# EAGLE schematic Dazzler-noaudio (EAGLE 8.7.0)
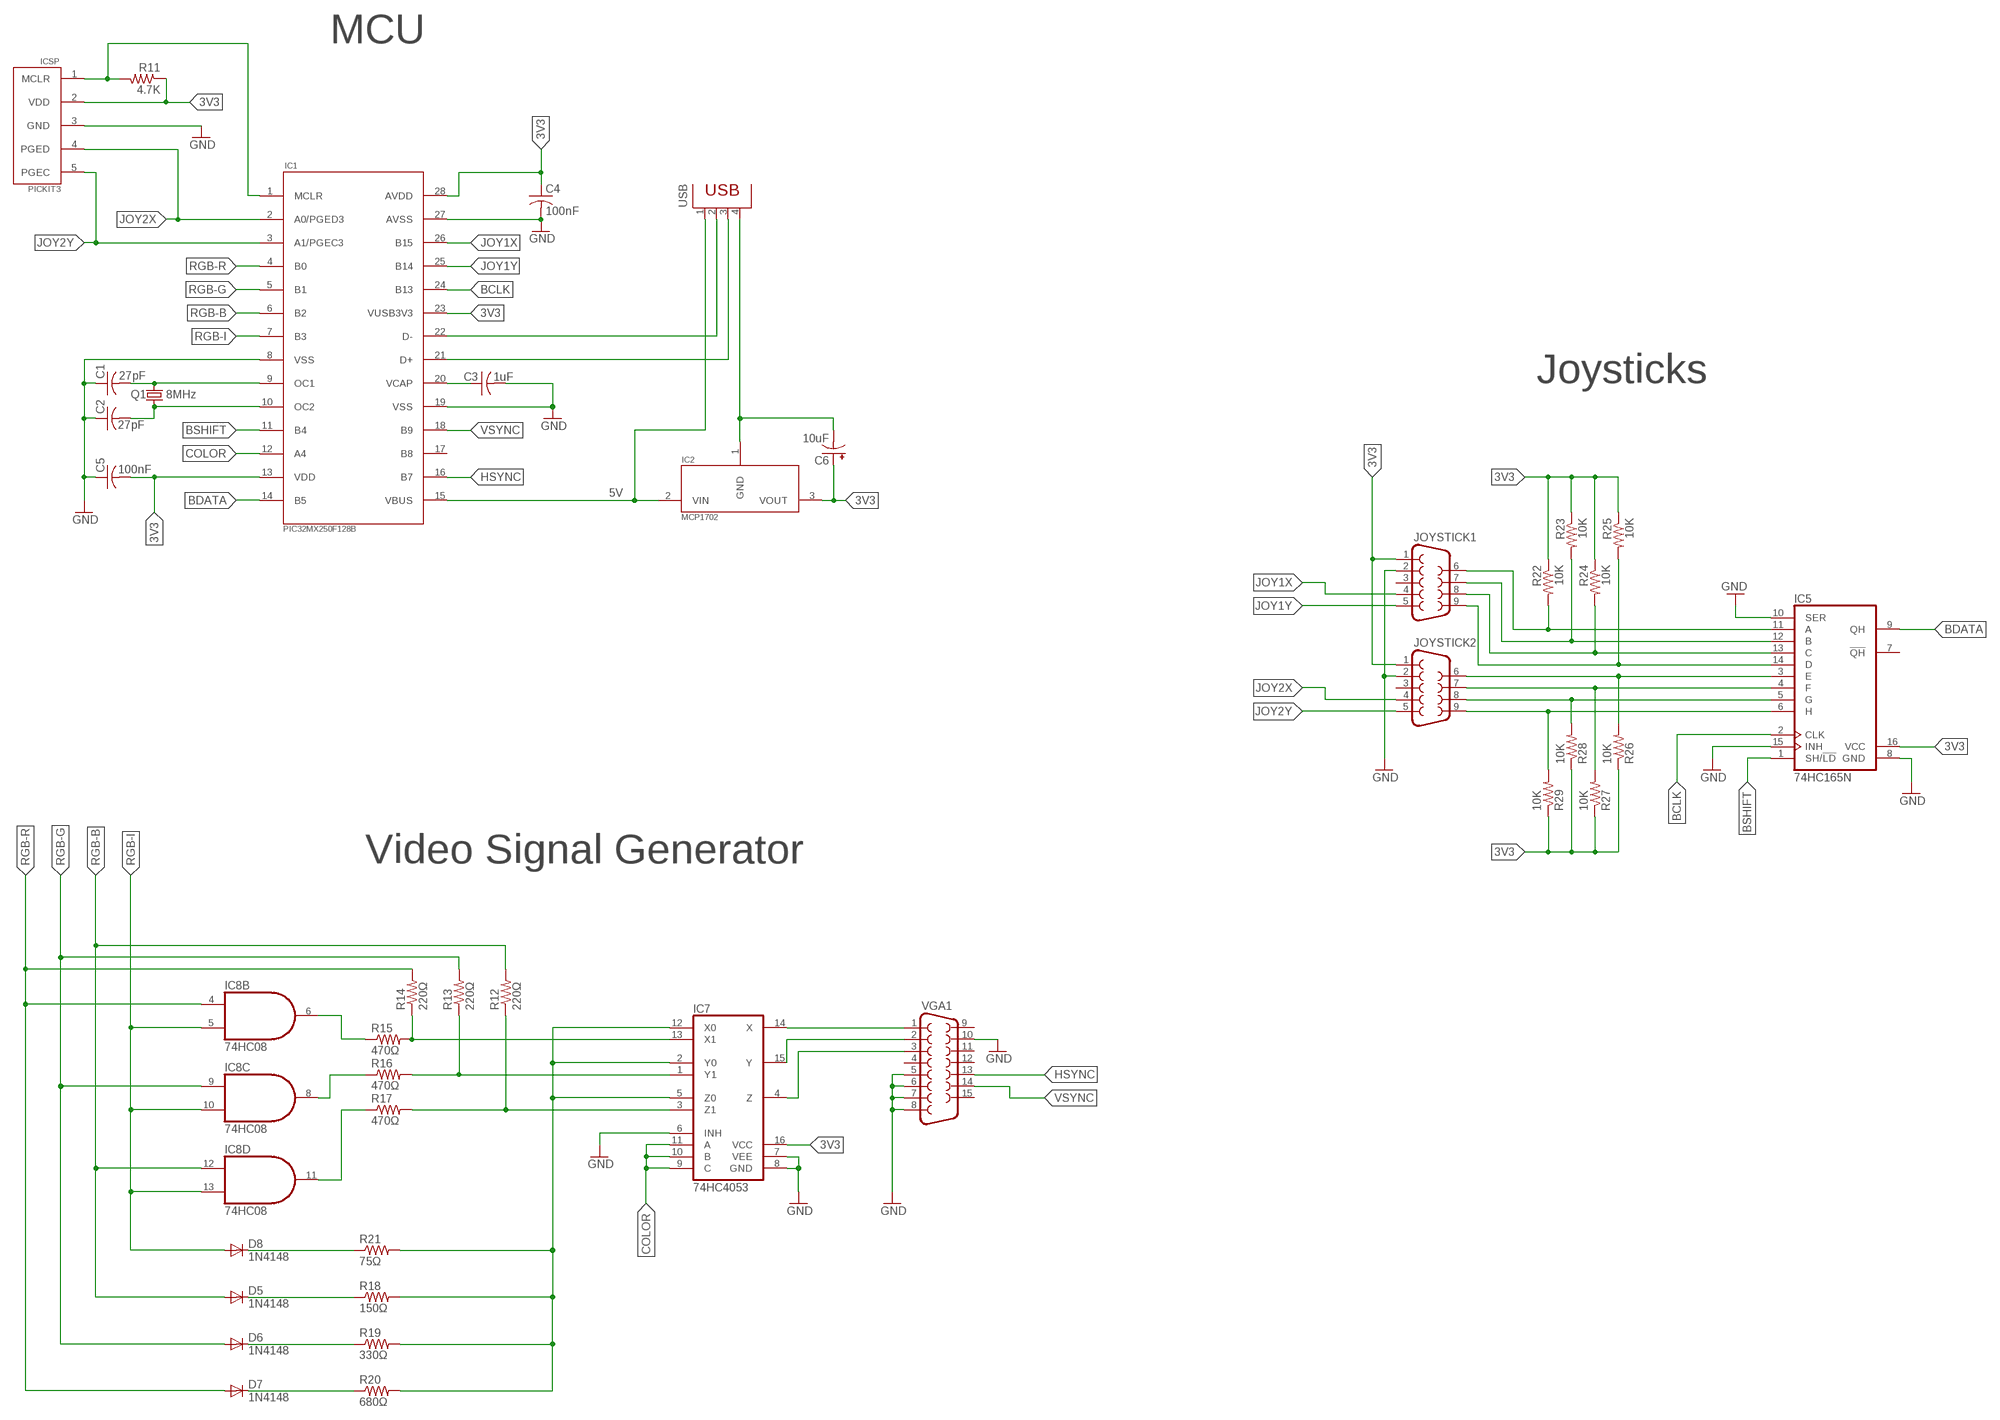
[diagram p0: schematic, sheet 1]

## Parts
C1  27pF  C-US025-024X044  [C025-024X044]
C2  27pF  C-US025-024X044  [C025-024X044]
C3  1uF  C-US025-024X044  [C025-024X044]
C4  100nF  C-US025-024X044  [C025-024X044]
C5  100nF  C-US025-024X044  [C025-024X044]
C6  10uF  CPOL-USE15-6AXIAL  [E15-6]
D5  1N4148  1N4148DO35-7  [DO35-7]
D6  1N4148  1N4148DO35-7  [DO35-7]
D7  1N4148  1N4148DO35-7  [DO35-7]
D8  1N4148  1N4148DO35-7  [DO35-7]
IC1  PIC32MX250F128B  [DIL28-3]
IC2  MCP1702  [TO92]
IC5  74HC165N  [DIL16]
IC7  74HC4053  4053N  [DIL16]
IC8  74HC08  74HC08N  [DIL14]
ICSP  PICKIT3  [1X05]
JOYSTICK1  F09V  [F09V]
JOYSTICK2  F09V  [F09V]
Q1  8MHz  CRYSTALHC33U-V  [HC33U-V]
R11  4.7K  R-US_0613/15  [P0613/15]
R12  220Ω  R-US_0613/15  [P0613/15]
R13  220Ω  R-US_0613/15  [P0613/15]
R14  220Ω  R-US_0613/15  [P0613/15]
R15  470Ω  R-US_0613/15  [P0613/15]
R16  470Ω  R-US_0613/15  [P0613/15]
R17  470Ω  R-US_0613/15  [P0613/15]
R18  150Ω  R-US_0613/15  [P0613/15]
R19  330Ω  R-US_0613/15  [P0613/15]
R20  680Ω  R-US_0613/15  [P0613/15]
R21  75Ω  R-US_0613/15  [P0613/15]
R22  10K  R-US_0613/15  [P0613/15]
R23  10K  R-US_0613/15  [P0613/15]
R24  10K  R-US_0613/15  [P0613/15]
R25  10K  R-US_0613/15  [P0613/15]
R26  10K  R-US_0613/15  [P0613/15]
R27  10K  R-US_0613/15  [P0613/15]
R28  10K  R-US_0613/15  [P0613/15]
R29  10K  R-US_0613/15  [P0613/15]
USB  PN61729  [PN61729]
VGA1  F15HDV  [HDF15V]

## Nets
3V3: C4.1 C5.2 C6.+ IC1.13(VDD) IC1.23(VUSB3V3) IC1.28(AVDD) IC2.3(VOUT) IC5.16(VCC) IC7.16(VCC) ICSP.2(VDD) JOYSTICK1.1 JOYSTICK2.1 R11.1 R22.1 R23.1 R24.1 R25.1 R26.1 R27.1 R28.1 R29.1
5V: IC1.15(VBUS) IC2.2(VIN) USB.1
BCLK: IC1.24(B13) IC5.2(CLK)
BDATA: IC1.14(B5) IC5.9(QH)
BSHIFT: IC1.11(B4) IC5.1(SH/!LD)
COLOR: IC1.12(A4) IC7.9(C) IC7.10(B) IC7.11(A)
GND: C1.1 C2.1 C3.2 C4.2 C5.1 IC1.8(VSS) IC1.19(VSS) IC1.27(AVSS) IC5.8(GND) IC5.10(SER) IC5.15(INH) IC7.6(INH) IC7.7(VEE) IC7.8(GND) ICSP.3(GND) JOYSTICK1.2 JOYSTICK2.2 VGA1.5 VGA1.6 VGA1.7 VGA1.8 VGA1.10
HSYNC: IC1.16(B7) VGA1.13
JOY1X: IC1.26(B15) JOYSTICK1.4
JOY1Y: IC1.25(B14) JOYSTICK1.5
JOY2X: IC1.2(A0/PGED3) ICSP.4(PGED) JOYSTICK2.4
JOY2Y: IC1.3(A1/PGEC3) ICSP.5(PGEC) JOYSTICK2.5
N$17: IC1.1(MCLR) ICSP.1(MCLR) R11.2
N$18: IC5.6(H) JOYSTICK2.9 R29.2
N$19: IC5.5(G) JOYSTICK2.8 R28.2
N$20: IC5.4(F) JOYSTICK2.7 R27.2
N$21: IC5.3(E) JOYSTICK2.6 R26.2
N$22: IC5.14(D) JOYSTICK1.9 R25.2
N$23: IC5.13(C) JOYSTICK1.8 R24.2
N$24: IC5.12(B) JOYSTICK1.7 R23.2
N$25: IC5.11(A) JOYSTICK1.6 R22.2
N$26: C1.2 IC1.9(OC1) Q1.2
N$27: C2.2 IC1.10(OC2) Q1.1
N$28: C6.- IC2.1(GND) USB.4
N$29: IC1.22(D-) USB.2
N$30: IC1.21(D+) USB.3
N$34: C3.1 IC1.20(VCAP)
N$38: IC7.14(X) VGA1.1
N$39: IC7.15(Y) VGA1.2
N$40: IC7.4(Z) VGA1.3
N$41: IC7.13(X1) R14.1 R15.2
N$42: IC7.1(Y1) R13.1 R16.2
N$43: IC7.3(Z1) R12.1 R17.2
N$44: IC8.6(B:O) R15.1
N$45: IC8.8(C:O) R16.1
N$46: IC8.11(D:O) R17.1
N$47: D5.C R18.1
N$48: D6.C R19.1
N$49: D7.C R20.1
N$50: D8.C R21.1
N$51: IC7.2(Y0) IC7.5(Z0) IC7.12(X0) R18.2 R19.2 R20.2 R21.2
RGB-B: D5.A IC1.6(B2) IC8.12(D:I0) R12.2
RGB-G: D6.A IC1.5(B1) IC8.9(C:I0) R13.2
RGB-I: D8.A IC1.7(B3) IC8.5(B:I1) IC8.10(C:I1) IC8.13(D:I1)
RGB-R: D7.A IC1.4(B0) IC8.4(B:I0) R14.2
VSYNC: IC1.18(B9) VGA1.14
Unconnected: IC1.17(B8) IC5.7(!QH) IC8.1(A:I0) IC8.2(A:I1) IC8.3(A:O) JOYSTICK1.3 JOYSTICK2.3 VGA1.4 VGA1.9 VGA1.11 VGA1.12 VGA1.15

## Notes on the sheet
- MCU
- Joysticks
- Video Signal Generator

## Power pins joined to a net without a drawn wire
GND: IC8.7(P:GND)
VCC: IC8.14(P:VCC)

## Library data of the parts
C1-C5 = rcl:C-US: CAPACITOR, American symbol; SPICEPREFIX: C
C6 = rcl:CPOL-US: POLARIZED CAPACITOR, American symbol; SPICEPREFIX: C
D5-D8 = diode:1N4148: DIODE high speed (Philips)
IC1 = pic32mx250:PIC32MX250F128B
IC2 = pic32mx250:MCP1702
IC5 = 74hc:74*165: 8-bit parallel load SHIFT REGISTER
IC7 = 74hc:4053: Triple 2-channel ANALOG MULTIPLEXER
IC8 = 74hc:74*08: Quad 2-input AND gate
ICSP = pic32mx250:PICKIT3
JOYSTICK1 JOYSTICK2 = con-subd:F09: SUB-D; OC_FARNELL: unknown; OC_NEWARK: unknown
Q1 = crystal:CRYSTAL: CRYSTAL; OC_FARNELL: unknown; OC_NEWARK: unknown
R11-R29 = resistor:R-US_: RESISTOR, American symbol
USB = con-berg:PN61729: BERG USB connector; OC_FARNELL: unknown; OC_NEWARK: unknown
VGA1 = con-subd:F15: SUB-D; OC_FARNELL: unknown; OC_NEWARK: unknown